# Altium schematic sheet OV7725_CRYSTAL.SchDoc
size A4
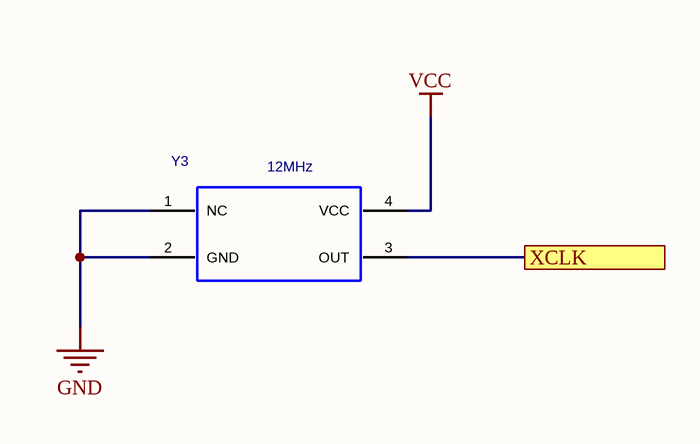
[diagram p0: OV7725_CRYSTAL.SchDoc]

## Parts
Y3  value 12MHz  [CRYSTAL_SMD3.2X2.5_FIRE]  (hidden comment: CRYSTAL_12MHZ_FIRE)

## Ports
XCLK

## Nets
GND: Y3.1(NC) Y3.2(GND)
VCC: Y3.4(VCC)
XCLK: Y3.3(OUT) ; port XCLK

## Library data of the parts
Y3 = CRYSTAL_12MHZ_FIRE: 12MHz; Manufacture 1 P/N: 12MHz; PCB DECAL: CRYSTAL_SMD3.2X2.5_FIRE